# EAGLE schematic board (EAGLE 5.11)
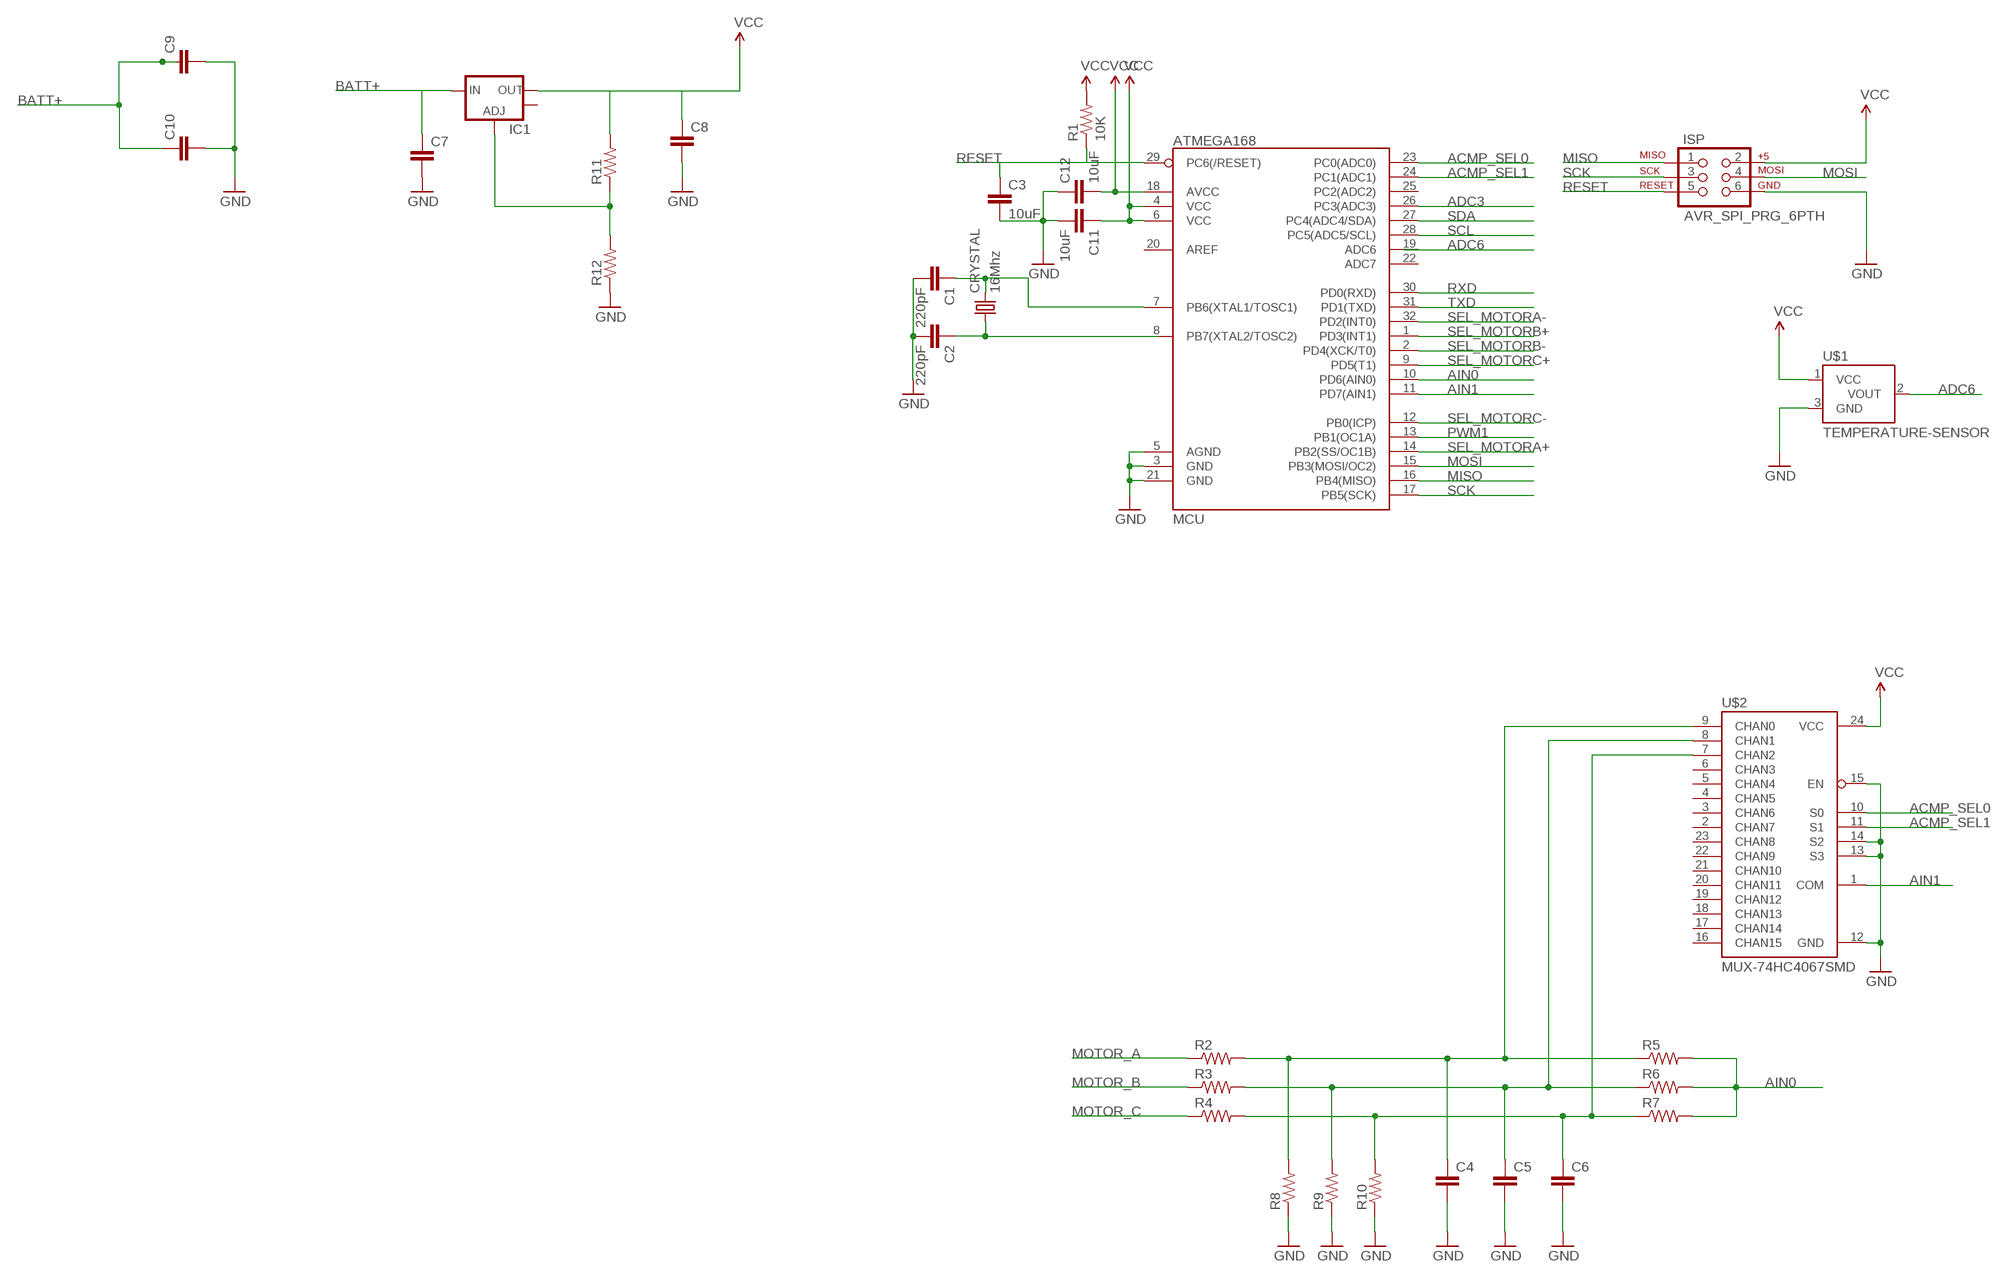
[diagram p0: schematic, sheet 1, part 1 of 2]
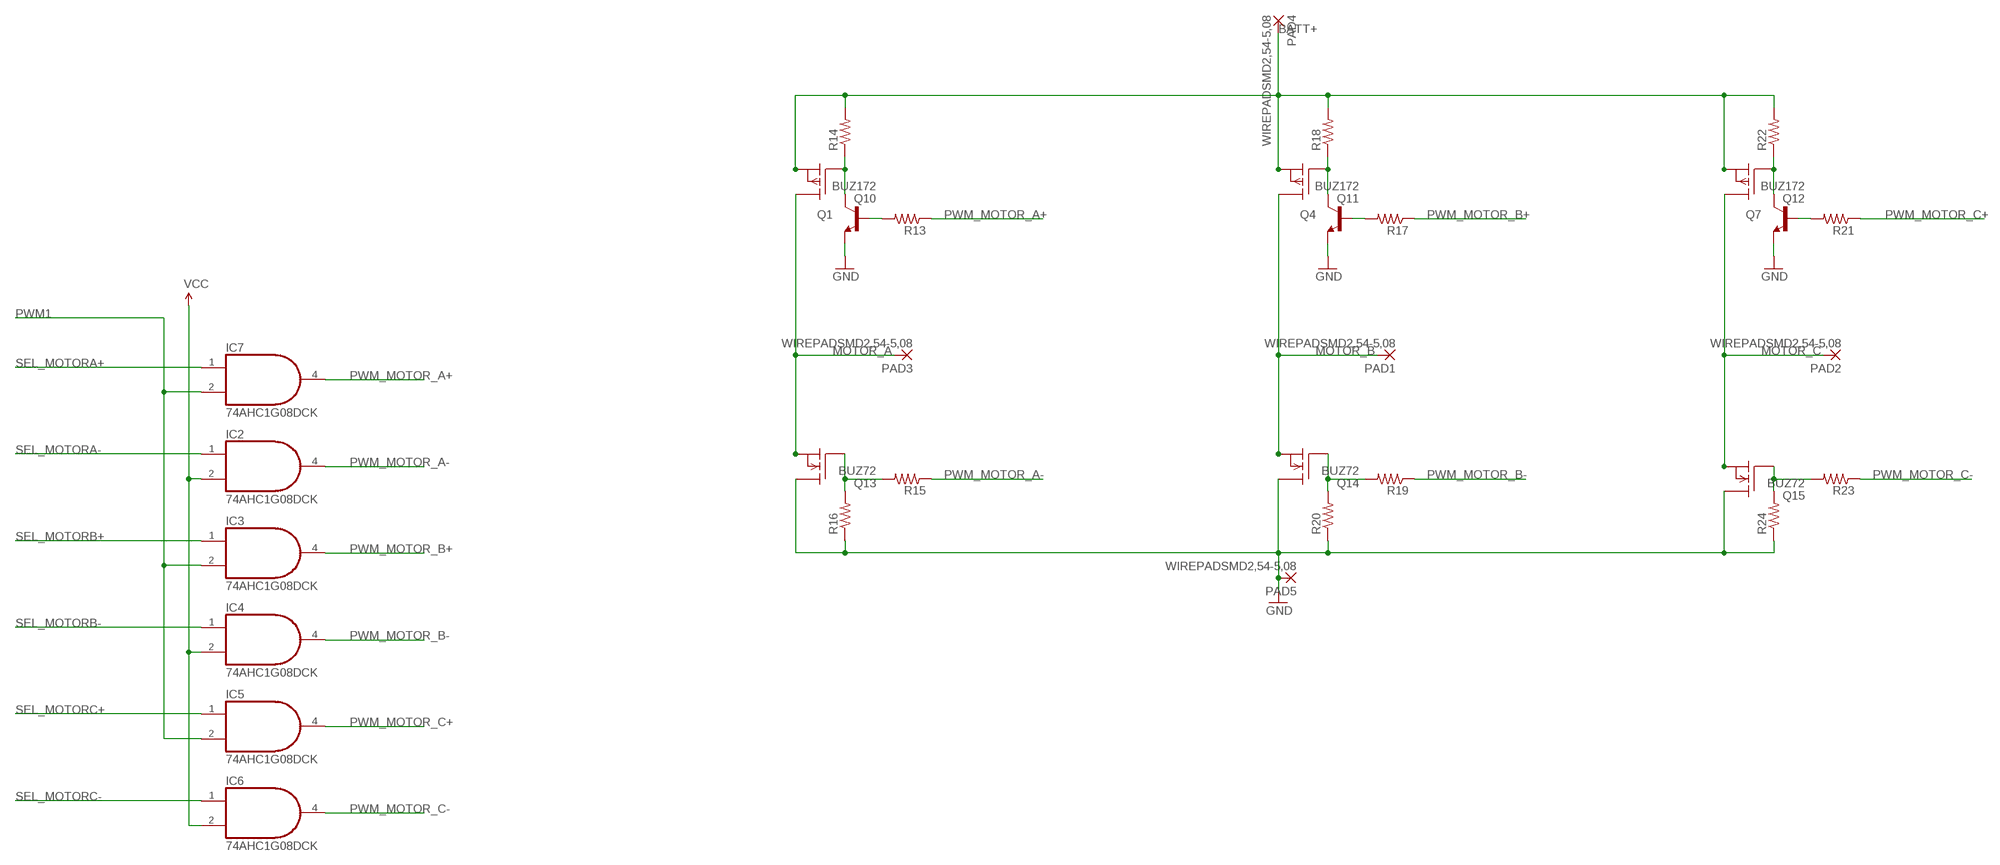
[diagram p1: schematic, sheet 1, part 2 of 2]

## Parts
C1  220pF  CAPPTH  [CAP-PTH-SMALL]
C2  220pF  CAPPTH  [CAP-PTH-SMALL]
C3  10uF  CAPPTH  [CAP-PTH-SMALL]
C4  CAPPTH  [CAP-PTH-SMALL]
C5  CAPPTH  [CAP-PTH-SMALL]
C6  CAPPTH  [CAP-PTH-SMALL]
C7  CAPPTH  [CAP-PTH-SMALL]
C8  CAPPTH  [CAP-PTH-SMALL]
C9  CAPPTH3  [CAP-PTH-LARGE]
C10  CAPPTH3  [CAP-PTH-LARGE]
C11  10uF  CAPPTH  [CAP-PTH-SMALL]
C12  10uF  CAPPTH  [CAP-PTH-SMALL]
CRYSTAL  16Mhz  CRYSTALHC49US  [HC49US]
IC1  V_REG_LM1117SOT223  [SOT223]
IC2  74AHC1G08DCK  [SC70-5]
IC3  74AHC1G08DCK  [SC70-5]
IC4  74AHC1G08DCK  [SC70-5]
IC5  74AHC1G08DCK  [SC70-5]
IC6  74AHC1G08DCK  [SC70-5]
IC7  74AHC1G08DCK  [SC70-5]
ISP  AVR_SPI_PRG_6PTH  [2X3]
MCU  ATMEGA168  [TQFP32-08]
PAD1  WIREPADSMD2,54-5,08  [SMD2,54-5,08]
PAD2  WIREPADSMD2,54-5,08  [SMD2,54-5,08]
PAD3  WIREPADSMD2,54-5,08  [SMD2,54-5,08]
PAD4  WIREPADSMD2,54-5,08  [SMD2,54-5,08]
PAD5  WIREPADSMD2,54-5,08  [SMD2,54-5,08]
Q1  TRANSISTOR_NPNTO92  [TO-92]
Q4  TRANSISTOR_NPNTO92  [TO-92]
Q7  TRANSISTOR_NPNTO92  [TO-92]
Q10  BUZ172  [TO220]
Q11  BUZ172  [TO220]
Q12  BUZ172  [TO220]
Q13  BUZ72  [TO220]
Q14  BUZ72  [TO220]
Q15  BUZ72  [TO220]
R1  10K  RESISTORPTH1  [AXIAL-0.3]
R2  RESISTORPTH1  [AXIAL-0.3]
R3  RESISTORPTH1  [AXIAL-0.3]
R4  RESISTORPTH1  [AXIAL-0.3]
R5  RESISTORPTH1  [AXIAL-0.3]
R6  RESISTORPTH1  [AXIAL-0.3]
R7  RESISTORPTH1  [AXIAL-0.3]
R8  RESISTORPTH1  [AXIAL-0.3]
R9  RESISTORPTH1  [AXIAL-0.3]
R10  RESISTORPTH1  [AXIAL-0.3]
R11  RESISTORPTH1  [AXIAL-0.3]
R12  RESISTORPTH1  [AXIAL-0.3]
R13  RESISTORPTH1  [AXIAL-0.3]
R14  RESISTORPTH1  [AXIAL-0.3]
R15  RESISTORPTH1  [AXIAL-0.3]
R16  RESISTORPTH1  [AXIAL-0.3]
R17  RESISTORPTH1  [AXIAL-0.3]
R18  RESISTORPTH1  [AXIAL-0.3]
R19  RESISTORPTH1  [AXIAL-0.3]
R20  RESISTORPTH1  [AXIAL-0.3]
R21  RESISTORPTH1  [AXIAL-0.3]
R22  RESISTORPTH1  [AXIAL-0.3]
R23  RESISTORPTH1  [AXIAL-0.3]
R24  RESISTORPTH1  [AXIAL-0.3]
U$1  TEMPERATURE-SENSOR  [TO-92]
U$2  MUX-74HC4067SMD  [SSOP24]

## Nets
ACMP_SEL0: MCU.23(PC0(ADC0)) U$2.10(S0)
ACMP_SEL1: MCU.24(PC1(ADC1)) U$2.11(S1)
ADC0: C4.1 R2.P$2 R5.P$1 R8.P$2 U$2.9(CHAN0)
ADC1: C5.1 R3.P$2 R6.P$1 R9.P$2 U$2.8(CHAN1)
ADC2: C6.1 R4.P$2 R7.P$1 R10.P$2 U$2.7(CHAN2)
ADC3: MCU.26(PC3(ADC3))
ADC6: U$1.2(VOUT)
AIN0: MCU.10(PD6(AIN0)) R5.P$2 R6.P$2 R7.P$2
AIN1: MCU.11(PD7(AIN1)) U$2.1(COM)
BATT+: C7.1 C9.1 C10.1 IC1.3(IN) PAD4.1(P) Q10.3(S) Q11.3(S) Q12.3(S) R14.P$2 R18.P$2 R22.P$2
GND: C1.2 C2.2 C3.2 C4.2 C5.2 C6.2 C7.2 C8.2 C9.2 C10.2 C11.2 C12.1 ISP.6 MCU.3(GND) MCU.5(AGND) MCU.21(GND) PAD5.1(P) Q1.1(E) Q4.1(E) Q7.1(E) Q13.2(D) Q14.2(D) Q15.2(D) R8.P$1 R9.P$1 R10.P$1 R12.P$1 R16.P$1 R20.P$1 R24.P$1 U$1.3(GND) U$2.12(GND) U$2.13(S3) U$2.14(S2) U$2.15(EN)
MISO: ISP.1 MCU.16(PB4(MISO))
MOSI: ISP.4 MCU.15(PB3(MOSI/OC2))
MOTOR_A: PAD3.1(P) Q10.2(D) Q13.3(S) R2.P$1
MOTOR_B: PAD1.1(P) Q11.2(D) Q14.3(S) R3.P$1
MOTOR_C: PAD2.1(P) Q12.2(D) Q15.3(S) R4.P$1
N$1: Q14.1(G) R19.P$2 R20.P$2
N$2: C2.1 CRYSTAL.1
N$3: C1.1 CRYSTAL.2 MCU.7(PB6(XTAL1/TOSC1))
N$4: Q1.2(B) R13.P$2
N$5: Q1.3(C) Q10.1(G) R14.P$1
N$7: IC1.1(ADJ) R11.P$1 R12.P$2
N$8: Q13.1(G) R15.P$2 R16.P$2
N$11: Q4.2(B) R17.P$2
N$12: Q4.3(C) Q11.1(G) R18.P$1
N$16: Q7.2(B) R21.P$2
N$19: Q7.3(C) Q12.1(G) R22.P$1
N$21: Q15.1(G) R23.P$2 R24.P$2
PWM1: IC3.2(I1) IC5.2(I1) IC7.2(I1) MCU.13(PB1(OC1A))
PWM_MOTOR_A+: IC7.4(O) R13.P$1
PWM_MOTOR_A-: IC2.4(O) R15.P$1
PWM_MOTOR_B+: IC3.4(O) R17.P$1
PWM_MOTOR_B-: IC4.4(O) R19.P$1
PWM_MOTOR_C+: IC5.4(O) R21.P$1
PWM_MOTOR_C-: IC6.4(O) R23.P$1
RESET: C3.1 ISP.5 MCU.29(PC6(/RESET)) R1.P$1
RXD: MCU.30(PD0(RXD))
SCK: ISP.3 MCU.17(PB5(SCK))
SCL: MCU.28(PC5(ADC5/SCL))
SDA: MCU.27(PC4(ADC4/SDA))
SEL_MOTORA+: IC7.1(I0) MCU.14(PB2(SS/OC1B))
SEL_MOTORA-: IC2.1(I0) MCU.32(PD2(INT0))
SEL_MOTORB+: IC3.1(I0) MCU.1(PD3(INT1))
SEL_MOTORB-: IC4.1(I0) MCU.2(PD4(XCK/T0))
SEL_MOTORC+: IC5.1(I0) MCU.9(PD5(T1))
SEL_MOTORC-: IC6.1(I0) MCU.12(PB0(ICP))
TXD: MCU.31(PD1(TXD))
VCC: C8.1 C11.1 C12.2 IC1.2(OUT) IC2.2(I1) IC4.2(I1) IC6.2(I1) ISP.2 MCU.4(VCC) MCU.6(VCC) MCU.18(AVCC) R1.P$2 R11.P$2 U$1.1(VCC) U$2.24(VCC)
Unconnected: IC1.4(OUT) MCU.8(PB7(XTAL2/TOSC2)) MCU.19(ADC6) MCU.20(AREF) MCU.22(ADC7) MCU.25(PC2(ADC2)) U$2.2(CHAN7) U$2.3(CHAN6) U$2.4(CHAN5) U$2.5(CHAN4) U$2.6(CHAN3) U$2.16(CHAN15) U$2.17(CHAN14) U$2.18(CHAN13) U$2.19(CHAN12) U$2.20(CHAN11) U$2.21(CHAN10) U$2.22(CHAN9) U$2.23(CHAN8)

## Power pins joined to a net without a drawn wire
GND: IC2.3(GND) IC3.3(GND) IC4.3(GND) IC5.3(GND) IC6.3(GND) IC7.3(GND)
VCC: IC2.5(VCC) IC3.5(VCC) IC4.5(VCC) IC5.5(VCC) IC6.5(VCC) IC7.5(VCC)

## Library data of the parts
C1-C12 = SparkFun:CAP: Capacitor Standard 0603 ceramic capacitor, and 0.1" leaded capacitor.
CRYSTAL = SparkFun:CRYSTAL: Crystals Various standard crystals. Proven footprints. Spark Fun Electronics SKU : COM-00534
IC1 = SparkFun:V_REG_LM1117: Voltage Regulator LM1117 Standard adjustable voltage regulator but in SMD form. Spark Fun Electronics SKU : COM-00595
IC2-IC7 = 74xx-little-us:74*1G08: 2-input AND gate
ISP = SparkFun:AVR_SPI_PRG_6: AVR ISP 6 Pin This is the reduced ISP connector for AVR programming. Common on Arduino. This footprint will take up less PCB space and can be used with a 10-pin to 6-pin adapter such as SKU: BOB-08508
MCU = SparkFun:ATMEGA168
PAD1-PAD5 = wirepad:WIREPAD: Wire PAD connect wire on PCB
Q1 Q4 Q7 = SparkFun:TRANSISTOR_NPN: Transistor NPN BJT configuration in SOT23 package. MMBT2222 is the common NPN we use. Double check BCE configuration again layout.
Q10-Q12 = transistor-fet:BUZ172: P-Channel Enhancement MOSFET -100V; -5A; 0,8Ohm
Q13-Q15 = transistor-fet:BUZ72: N-Channel Enhancement MOSFET 100V; 10A; 0,2Ohm
R1-R24 = SparkFun:RESISTOR: Resistor Basic schematic elements and footprints for 0603, 1206, and PTH 1/10th watt (small) resistors.
U$1 = SparkFun:TEMPERATURE-SENSOR
U$2 = SparkFun:MUX-74HC4067